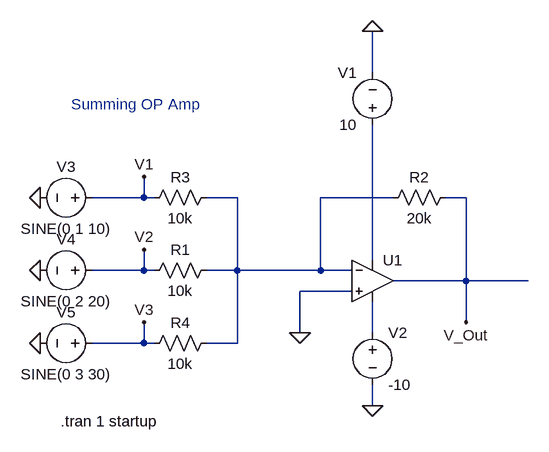
[diagram p0: schematic Summing_OP_Amp.asc]
Summing_OP_Amp.asc, the LTspice schematic file:
Version 4.1
SHEET 1 880 680
WIRE 160 -160 160 -224
WIRE -192 32 -192 0
WIRE -192 32 -272 32
WIRE -176 32 -192 32
WIRE -48 32 -96 32
WIRE 192 32 80 32
WIRE 304 32 272 32
WIRE 160 128 160 -80
WIRE -192 144 -192 112
WIRE -192 144 -272 144
WIRE -176 144 -192 144
WIRE -48 144 -48 32
WIRE -48 144 -96 144
WIRE 80 144 80 32
WIRE 80 144 -48 144
WIRE 128 144 80 144
WIRE 304 160 304 32
WIRE 304 160 192 160
WIRE 400 160 304 160
WIRE 128 176 48 176
WIRE 304 224 304 160
WIRE 48 240 48 176
WIRE 160 240 160 192
WIRE -192 256 -192 224
WIRE -192 256 -272 256
WIRE -176 256 -192 256
WIRE -48 256 -48 144
WIRE -48 256 -96 256
WIRE 160 352 160 320
FLAG 160 352 0
FLAG 160 -224 0
FLAG 48 240 0
FLAG -352 32 0
FLAG -352 144 0
FLAG -352 256 0
FLAG -192 112 V2
FLAG -192 0 V1
FLAG -192 224 V3
FLAG 304 224 V_Out
SYMBOL OpAmps\\UniversalOpAmp2 160 160 R0
SYMATTR InstName U1
SYMBOL voltage 160 224 R0
WINDOW 123 0 0 Left 0
WINDOW 39 0 0 Left 0
SYMATTR InstName V2
SYMATTR Value -10
SYMBOL res 288 16 R90
WINDOW 0 0 56 VBottom 2
WINDOW 3 32 56 VTop 2
SYMATTR InstName R2
SYMATTR Value 20k
SYMBOL voltage 160 -64 R180
WINDOW 0 24 96 Left 2
WINDOW 3 24 16 Left 2
WINDOW 123 0 0 Left 0
WINDOW 39 0 0 Left 0
SYMATTR InstName V1
SYMATTR Value 10
SYMBOL res -80 128 R90
WINDOW 0 0 56 VBottom 2
WINDOW 3 32 56 VTop 2
SYMATTR InstName R1
SYMATTR Value 10k
SYMBOL res -80 16 R90
WINDOW 0 0 56 VBottom 2
WINDOW 3 32 56 VTop 2
SYMATTR InstName R3
SYMATTR Value 10k
SYMBOL res -80 240 R90
WINDOW 0 0 56 VBottom 2
WINDOW 3 32 56 VTop 2
SYMATTR InstName R4
SYMATTR Value 10k
SYMBOL voltage -256 32 R90
WINDOW 0 -32 56 VBottom 2
WINDOW 3 32 56 VTop 2
WINDOW 123 0 0 Left 0
WINDOW 39 0 0 Left 0
SYMATTR InstName V3
SYMATTR Value SINE(0 1 10)
SYMBOL voltage -256 144 R90
WINDOW 0 -32 56 VBottom 2
WINDOW 3 32 56 VTop 2
WINDOW 123 0 0 Left 0
WINDOW 39 0 0 Left 0
SYMATTR InstName V4
SYMATTR Value SINE(0 2 20)
SYMBOL voltage -256 256 R90
WINDOW 0 -32 56 VBottom 2
WINDOW 3 32 56 VTop 2
WINDOW 123 0 0 Left 0
WINDOW 39 0 0 Left 0
SYMATTR InstName V5
SYMATTR Value SINE(0 3 30)
TEXT -320 376 Left 2 !.tran 1 startup
TEXT -304 -112 Left 2 ;Summing OP Amp

The netlist it stands for:
* Summing_OP_Amp.asc
X§U1 0 N001 N002 N003 V_Out level2 Avol=1Meg GBW=10Meg Slew=10Meg Ilimit=25m Rail=0 Vos=0 En=0 Enk=0 In=0 Ink=0 Rin=500Meg  ; pins In+ In- V+ V- OUT
V2 N003 0 -10
R2 V_Out N001 20k
V1 N002 0 10
R1 N001 V2 10k
R3 N001 V1 10k
R4 N001 V3 10k
V3 V1 0 SINE(0 1 10)
V4 V2 0 SINE(0 2 20)
V5 V3 0 SINE(0 3 30)
.tran 1 startup
* Summing OP Amp
.lib UniversalOpAmp2.lib
.backanno
.end